# EAGLE design ripples_v40 (EAGLE 5.09)
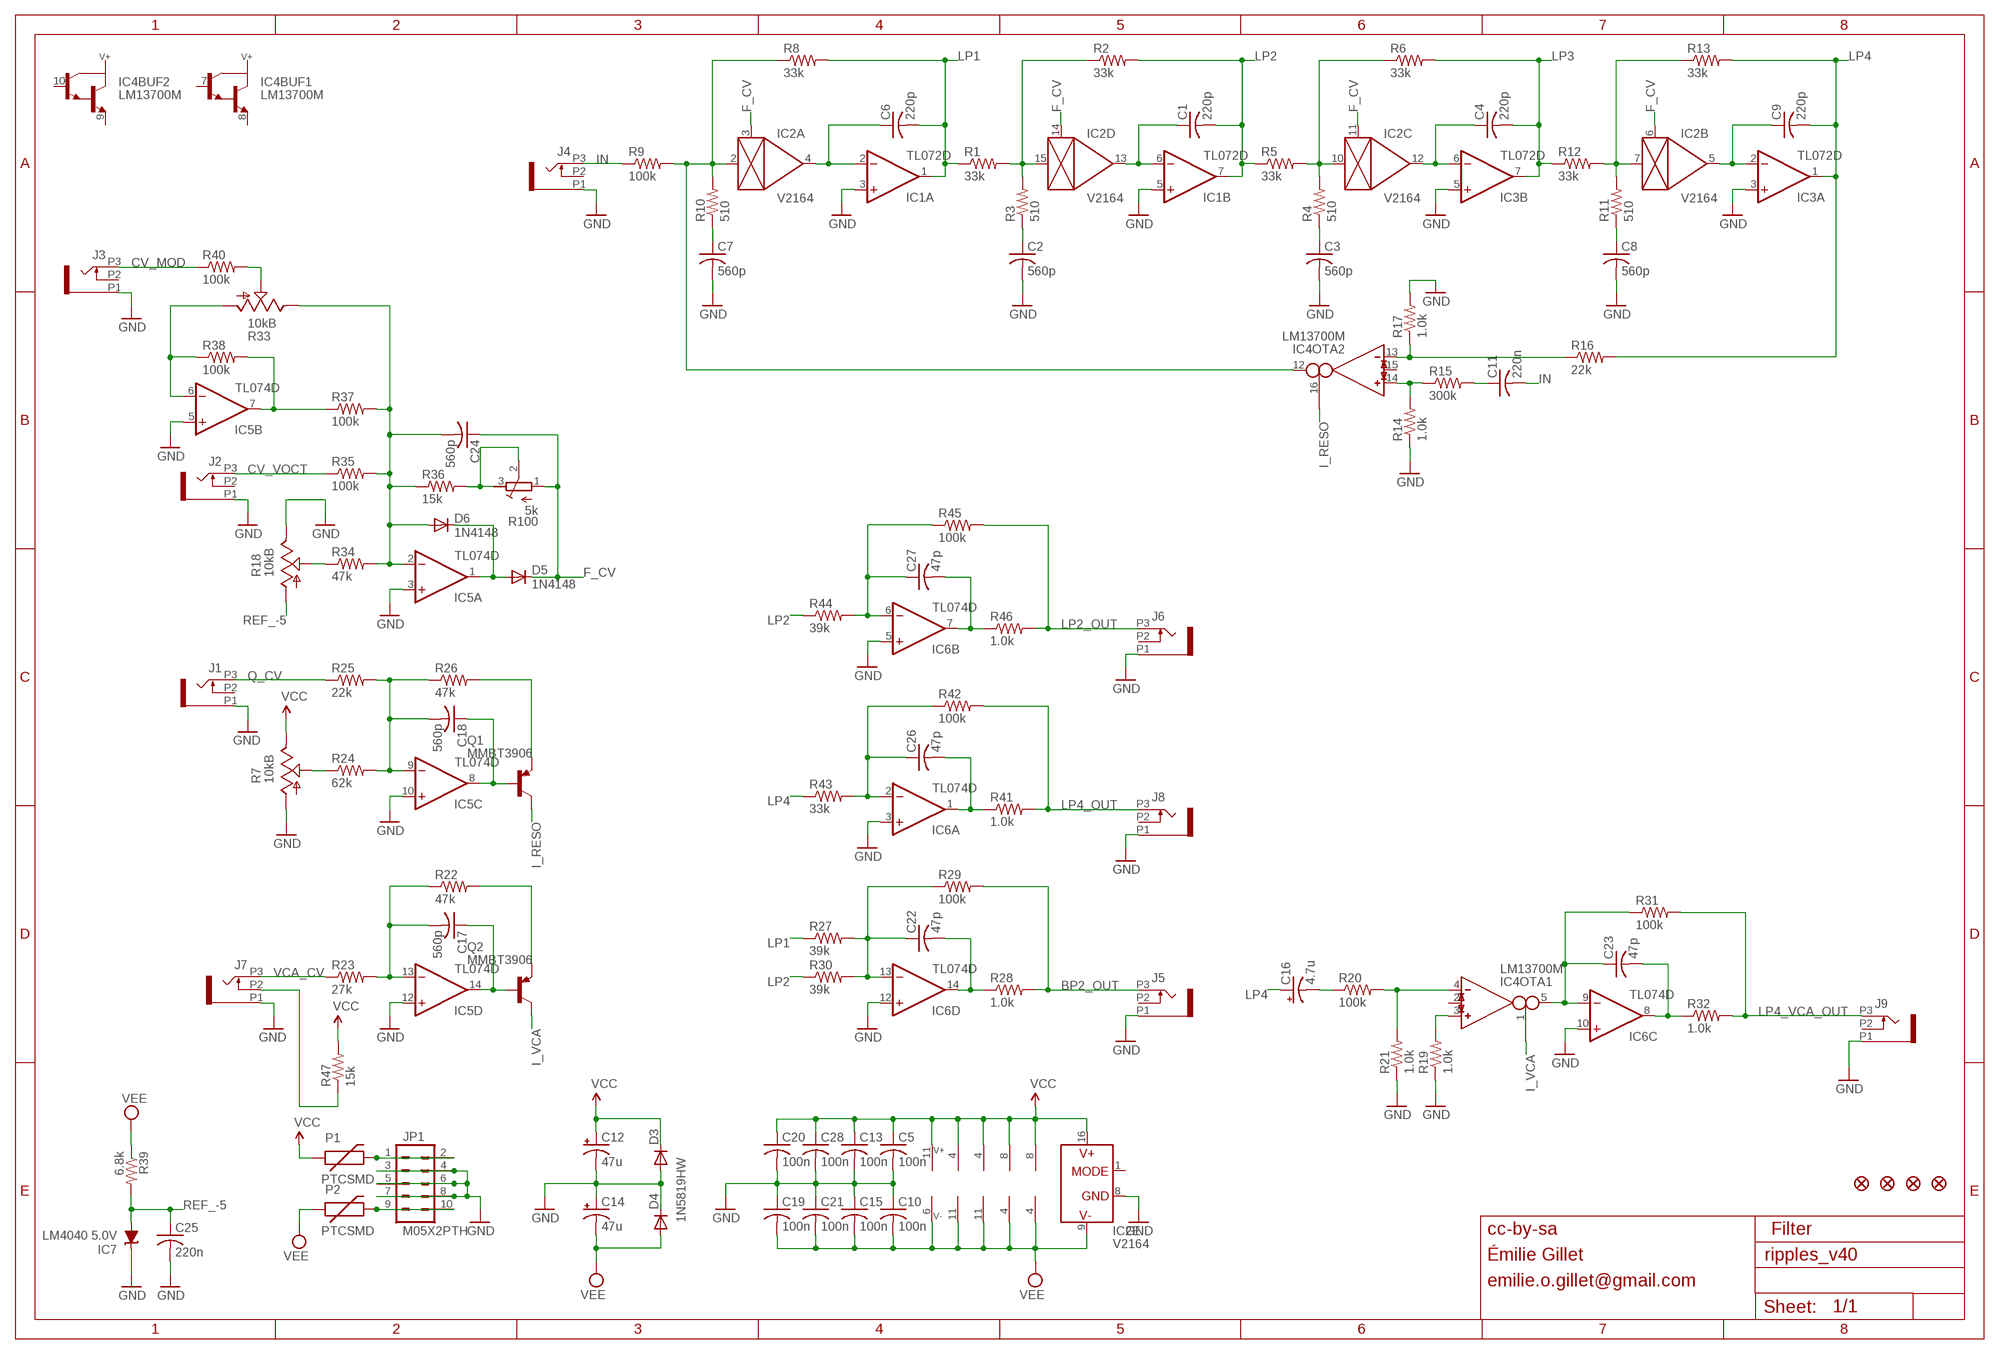
[diagram p0: schematic, sheet 1]

## Parts
C1  220p  C-USC0603  [C0603]
C2  560p  C-USC0603  [C0603]
C3  560p  C-USC0603  [C0603]
C4  220p  C-USC0603  [C0603]
C5  100n  C-USC0603  [C0603]
C6  220p  C-USC0603  [C0603]
C7  560p  C-USC0603  [C0603]
C8  560p  C-USC0603  [C0603]
C9  220p  C-USC0603  [C0603]
C10  100n  C-USC0603  [C0603]
C11  220n  C-USC0603  [C0603]
C12  47u  CPOL-USD  [PANASONIC_D]
C13  100n  C-USC0603  [C0603]
C14  47u  CPOL-USD  [PANASONIC_D]
C15  100n  C-USC0603  [C0603]
C16  4.7u  CPOL-USB  [PANASONIC_B]
C17  560p  C-USC0603  [C0603]
C18  560p  C-USC0603  [C0603]
C19  100n  C-USC0603  [C0603]
C20  100n  C-USC0603  [C0603]
C21  100n  C-USC0603  [C0603]
C22  47p  C-USC0603  [C0603]
C23  47p  C-USC0603  [C0603]
C24  560p  C-USC0603  [C0603]
C25  220n  C-USC0603  [C0603]
C26  47p  C-USC0603  [C0603]
C27  47p  C-USC0603  [C0603]
C28  100n  C-USC0603  [C0603]
D3  1N5819HW  DIODE-SOD123  [SOD123]
D4  1N5819HW  DIODE-SOD123  [SOD123]
D5  1N4148  DIODE-SOD323-W  [SOD323-W]
D6  1N4148  DIODE-SOD323-W  [SOD323-W]
F1  FIDUCIAL1X2  [FIDUCIAL-1X2]
F2  FIDUCIAL1X2  [FIDUCIAL-1X2]
F3  FIDUCIAL1X2  [FIDUCIAL-1X2]
F4  FIDUCIAL1X2  [FIDUCIAL-1X2]
IC1  TL072D  [SO08]
IC2  V2164  SSM2164S  [SOIC16N]
IC3  TL072D  [SO08]
IC4  LM13700M  [SO16]
IC5  TL074D  [SO14]
IC6  TL074D  [SO14]
IC7  LM4040 5.0V  LM4041C12DBZ  [DBZ_R-PDSO-G3]
J1  PJ301_THONKICONN6  [WQP_PJ_301M6]
J2  PJ301_THONKICONN6  [WQP_PJ_301M6]
J3  PJ301_THONKICONN6  [WQP_PJ_301M6]
J4  PJ301_THONKICONN6  [WQP_PJ_301M6]
J5  PJ301_THONKICONN6  [WQP_PJ_301M6]
J6  PJ301_THONKICONN6  [WQP_PJ_301M6]
J7  PJ301_THONKICONN6  [WQP_PJ_301M6]
J8  PJ301_THONKICONN6  [WQP_PJ_301M6]
J9  PJ301_THONKICONN6  [WQP_PJ_301M6]
JP1  M05X2PTH  [AVR_ICSP]
P1  PTCSMD  [PTC-1206]
P2  PTCSMD  [PTC-1206]
Q1  MMBT3906  MMBT3906LT1-PNP-SOT23-BEC  [SOT23-BEC]
Q2  MMBT3906  MMBT3906LT1-PNP-SOT23-BEC  [SOT23-BEC]
R1  33k  R-US_R0603  [R0603]
R2  33k  R-US_R0603  [R0603]
R3  510  R-US_R0603  [R0603]
R4  510  R-US_R0603  [R0603]
R5  33k  R-US_R0603  [R0603]
R6  33k  R-US_R0603  [R0603]
R7  10kB  POT_USVERTICAL_PS  [ALPS_POT_VERTICAL_PS]
R8  33k  R-US_R0603  [R0603]
R9  100k  R-US_R0603  [R0603]
R10  510  R-US_R0603  [R0603]
R11  510  R-US_R0603  [R0603]
R12  33k  R-US_R0603  [R0603]
R13  33k  R-US_R0603  [R0603]
R14  1.0k  R-US_R0603  [R0603]
R15  300k  R-US_R0603  [R0603]
R16  22k  R-US_R0603  [R0603]
R17  1.0k  R-US_R0603  [R0603]
R18  10kB  POT_USVERTICAL_PS  [ALPS_POT_VERTICAL_PS]
R19  1.0k  R-US_R0603  [R0603]
R20  100k  R-US_R0603  [R0603]
R21  1.0k  R-US_R0603  [R0603]
R22  47k  R-US_R0603  [R0603]
R23  27k  R-US_R0603  [R0603]
R24  62k  R-US_R0603  [R0603]
R25  22k  R-US_R0603  [R0603]
R26  47k  R-US_R0603  [R0603]
R27  39k  R-US_R0603  [R0603]
R28  1.0k  R-US_R0603  [R0603]
R29  100k  R-US_R0603  [R0603]
R30  39k  R-US_R0603  [R0603]
R31  100k  R-US_R0603  [R0603]
R32  1.0k  R-US_R0603  [R0603]
R33  10kB  POT_USVERTICAL_PS  [ALPS_POT_VERTICAL_PS]
R34  47k  R-US_R0603  [R0603]
R35  100k  R-US_R0603  [R0603]
R36  15k  R-US_R0603  [R0603]
R37  100k  R-US_R0603  [R0603]
R38  100k  R-US_R0603  [R0603]
R39  6.8k  R-US_R0603  [R0603]
R40  100k  R-US_R0603  [R0603]
R41  1.0k  R-US_R0603  [R0603]
R42  100k  R-US_R0603  [R0603]
R43  33k  R-US_R0603  [R0603]
R44  39k  R-US_R0603  [R0603]
R45  100k  R-US_R0603  [R0603]
R46  1.0k  R-US_R0603  [R0603]
R47  15k  R-US_R0603  [R0603]
R100  5k  R-TRIMM3296X  [RTRIM3296X]

## Nets
BP2_OUT: J5.P3 R28.2 R29.2
CV_F_POT: R18.P$2(S) R34.1
CV_MOD: J3.P3 R40.1
CV_VOCT: J2.P3 R35.1
F_CV: C24.1 D5.C IC2.3(A:CTRL) IC2.6(B:CTRL) IC2.11(C:CTRL) IC2.14(D:CTRL) R100.1(E)
GND: C2.2 C3.2 C5.2 C7.2 C8.2 C10.1 C12.- C13.2 C14.+ C15.1 C19.1 C20.2 C21.1 C25.2 C28.2 D3.A D4.C IC1.3(A:+IN) IC1.5(B:+IN) IC2.8(E:GND) IC3.3(A:+IN) IC3.5(B:+IN) IC5.3(A:+IN) IC5.5(B:+IN) IC5.10(C:+IN) IC5.12(D:+IN) IC6.3(A:+IN) IC6.5(B:+IN) IC6.10(C:+IN) IC6.12(D:+IN) IC7.1(C) J1.P1 J2.P1 J3.P1 J4.P1 J5.P1 J6.P1 J7.P1 J8.P1 J9.P1 JP1.3 JP1.4 JP1.5 JP1.6 JP1.7 JP1.8 R7.P$3(A) R14.1 R17.2 R18.P$1(E) R19.1 R21.1
I_RESO: IC4.16(OTA2:I_BIAS) Q1.C
I_VCA: IC4.1(OTA1:I_BIAS) Q2.C
IN: C11.2 J4.P3 R9.1
LP1: C6.2 IC1.1(A:OUT) R1.1 R8.2 R27.1
LP2: C1.2 IC1.7(B:OUT) R2.2 R5.1 R30.1 R44.1
LP2_OUT: J6.P3 R45.2 R46.2
LP3: C4.2 IC3.7(B:OUT) R6.2 R12.1
LP4: C9.2 C16.+ IC3.1(A:OUT) R13.2 R16.2 R43.1
LP4_OUT: J8.P3 R41.2 R42.2
LP4_VCA_OUT: J9.P3 R31.2 R32.2
N$1: IC5.7(B:OUT) R37.1 R38.2
N$2: C6.1 IC1.2(A:-IN) IC2.4(A:OUT)
N$3: IC2.15(D:IN) R1.2 R2.1 R3.2
N$4: R36.2 R100.2(S) R100.3(A)
N$5: IC4.3(OTA1:IN_P) R19.2
N$6: JP1.1 JP1.2 P1.2
N$7: C11.1 R15.2
N$8: C7.1 R10.1
N$9: C1.1 IC1.6(B:-IN) IC2.13(D:OUT)
N$10: IC2.2(A:IN) IC4.12(OTA2:OUT) R8.1 R9.2 R10.2
N$11: C2.1 R3.1
N$12: IC2.10(C:IN) R4.2 R5.2 R6.1
N$13: C4.1 IC2.12(C:OUT) IC3.6(B:-IN)
N$14: IC4.13(OTA2:IN_N) R16.1 R17.1
N$15: C3.1 R4.1
N$16: IC2.7(B:IN) R11.2 R12.2 R13.1
N$17: C9.1 IC2.5(B:OUT) IC3.2(A:-IN)
N$18: IC4.14(OTA2:IN_P) R14.2 R15.1
N$19: C8.1 R11.1
N$20: JP1.9 JP1.10 P2.2
N$21: R33.P$2(S) R40.2
N$22: IC5.6(B:-IN) R33.P$3(A) R38.1
N$23: C24.2 D6.A IC5.2(A:-IN) R33.P$1(E) R34.2 R35.2 R36.1 R37.2
N$24: R7.P$2(S) R24.1
N$25: C17.2 IC5.13(D:-IN) R22.1 R23.2
N$26: C18.2 IC5.9(C:-IN) R24.2 R25.2 R26.1
N$27: C18.1 IC5.8(C:OUT) Q1.B
N$28: Q1.E R26.2
N$29: J7.P2 R47.1
N$30: C17.1 IC5.14(D:OUT) Q2.B
N$31: Q2.E R22.2
N$32: C27.1 IC6.6(B:-IN) R44.2 R45.1
N$33: C26.1 IC6.2(A:-IN) R42.1 R43.2
N$37: C26.2 IC6.1(A:OUT) R41.1
N$38: D5.A D6.C IC5.1(A:OUT)
N$39: C27.2 IC6.7(B:OUT) R46.1
N$40: C22.1 IC6.13(D:-IN) R27.2 R29.1 R30.2
N$41: C22.2 IC6.14(D:OUT) R28.1
N$42: IC4.4(OTA1:IN_N) R20.2 R21.2
N$43: C23.1 IC4.5(OTA1:OUT) IC6.9(C:-IN) R31.1
N$44: C23.2 IC6.8(C:OUT) R32.1
N$68: C16.- R20.1
Q_CV: J1.P3 R25.1
REF_-5: C25.1 IC7.2(A) R18.P$3(A) R39.2
VCA_CV: J7.P3 R23.1
VCC: C5.1 C12.+ C13.1 C20.1 C28.1 D3.C IC1.8(P:V+) IC2.16(E:V+) IC3.8(P:V+) IC4.11(SUPPLY:V+) IC5.4(P:V+) IC6.4(P:V+) P1.1 R7.P$1(E) R47.2
VEE: C10.2 C14.- C15.2 C19.2 C21.2 D4.A IC1.4(P:V-) IC2.9(E:V-) IC3.4(P:V-) IC4.6(SUPPLY:V-) IC5.11(P:V-) IC6.11(P:V-) P2.1 R39.1
Unconnected: IC2.1(E:MODE) IC4.2(OTA1:I_DIODE) IC4.7(BUF1:B) IC4.8(BUF1:E) IC4.9(BUF2:E) IC4.10(BUF2:B) IC4.15(OTA2:I_DIODE) J1.P2 J2.P2 J3.P2 J4.P2 J5.P2 J6.P2 J8.P2 J9.P2

## Notes on the sheet
- cc-by-sa | Filter
- Émilie Gillet
- emilie.o.gillet@gmail.com

## Library data of the parts
C1-C11 C13 C15 C17-C28 = rcl:C-US: CAPACITOR, American symbol
C12 C14 C16 = rcl:CPOL-US: POLARIZED CAPACITOR, American symbol
D3-D6 = diode:DIODE-: DIODE
F1-F4 = SparkFun:FIDUCIAL: Fiducial Alignment Points Various fiducial points for machine vision alignment.
IC1 IC3 = og-linear:TL072: OP AMP
IC2 = ssm2164:SSM2164
IC4 = ota:LM13700: Dual OTA with buffers
IC5 IC6 = gm-ics:TL074: OP AMP
IC7 = texas:LM4041: PRECISION MICROPOWER SHUNT VOLTAGE REFERENCE Source: http://focus.ti.com/lit/ds/slcs146e/slcs146e.pdf
J1-J9 = og-pj301:PJ301_THONKICONN
JP1 = og-header:M05X2: Header 5x2 Standard 10-pin dual row 0.1" header. Commonly used with AVR-ISP. Use with Spark Fun Electronics SKU: PRT-00778
P1 P2 = SparkFun:PTC: Resettable Fuse PTC Resettable Fuse. Spark Fun Electronics SKU : COM-08357
Q1 Q2 = transistor:*-PNP-: PNP Transistror
R1-R6 R8-R17 R19-R32 R34-R38 R40-R47 = rcl:R-US_: RESISTOR, American symbol
R7 R18 R33 = pot-alps:POT_US
R39 = resistor:R-US_: RESISTOR, American symbol
R100 = rcl:R-TRIMM: Trimm resistor

## Board
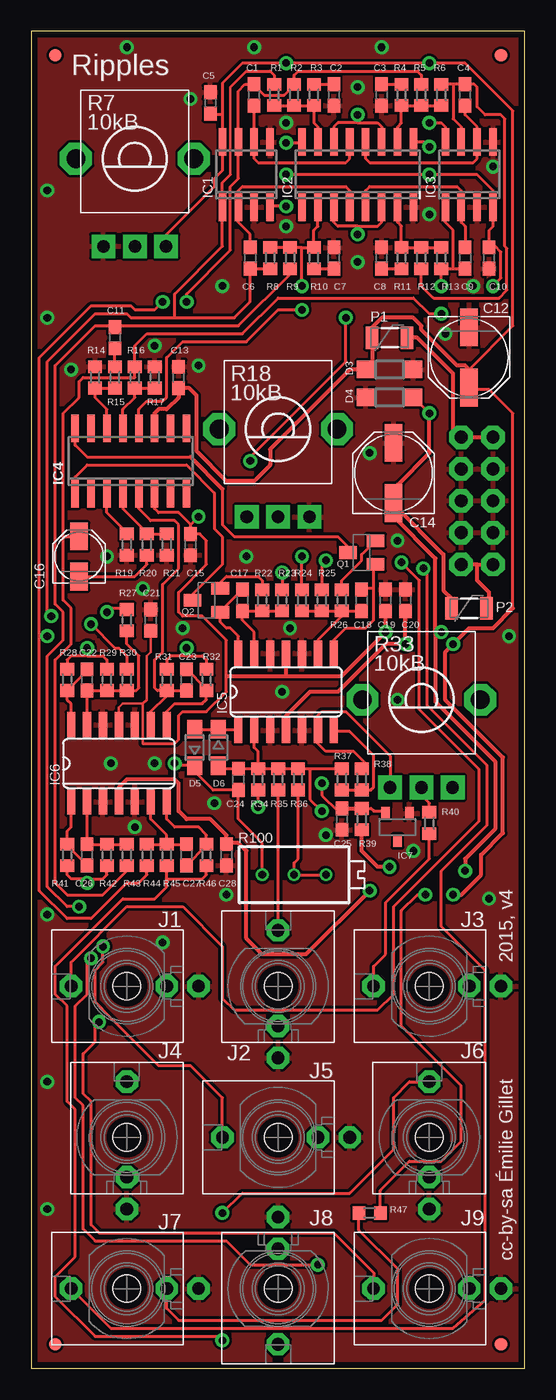
[diagram p1: board, top side]
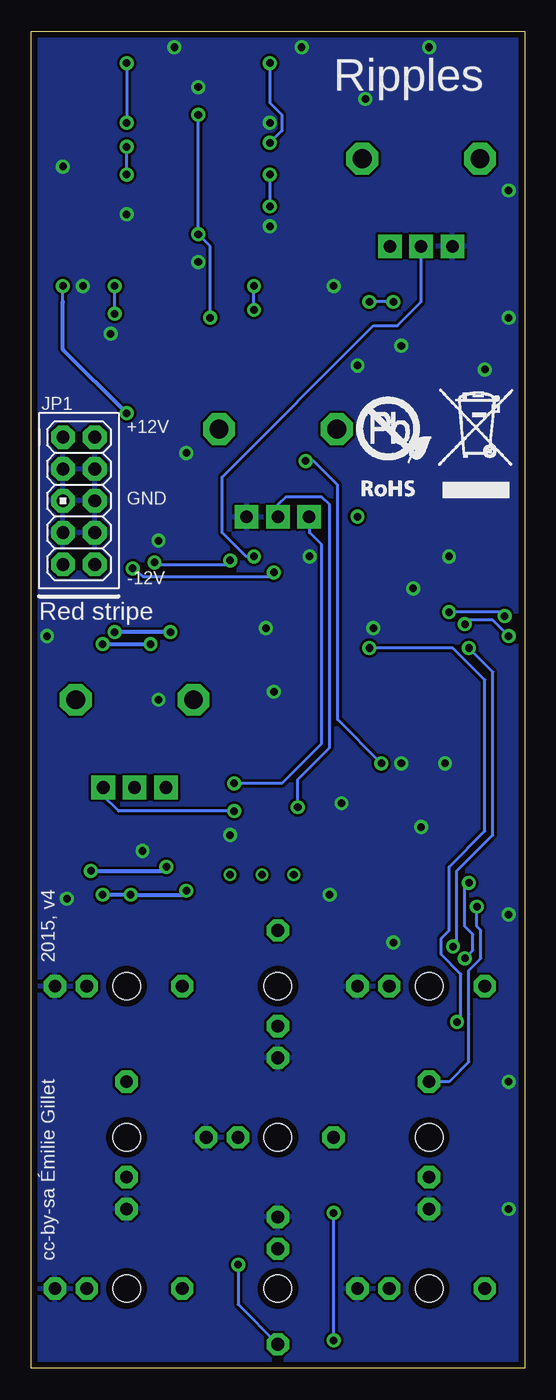
[diagram p2: board, bottom side, seen from below]

Size 39.35 x 106.68 mm. Coordinates in mm from the lower left corner, seen from the top.
Outline: 0,0 39.35,0 39.35,106.68 0,106.68 0,0
Copper layers (1*16): Top 0.035mm / dielectric 1.5mm / Bottom 0.035mm
Design rules "PCBCart-Standard *": minimum track width 8mil, minimum drill 0.4mm, track to track 8mil, track to pad 8mil, pad to pad 8mil, via to via 8mil, smd to smd 8mil, copper to edge 20mil, drill to drill 8mil, minimum pad ring 8mil, minimum via ring 10mil, stop-mask expansion 3mil, vias tented up to drill 25mil, thermal gap 8mil

### Footprints (pad centres in the part's own frame; a part is rotated, then mirrored left to right if it is on the bottom)
C0603 = smd 1.1 x 1: 1 -0.85,0; 2 0.85,0
PANASONIC_D = smd 3 x 1.4: + 2.4,0; - -2.4,0
PANASONIC_B = smd 2.2 x 1.4: + 1.6,0; - -1.6,0
SOD123 = smd 1.4 x 1.4: A 1.9,0; C -1.9,0
SOD323-W = smd 1.5 x 1.2: A 1.45,0; C -1.45,0
FIDUCIAL-1X2 = smd 1 x 1: 1 0,0
SO08 = smd 0.6 x 2.2: 1 -1.905,-2.6; 2 -0.635,-2.6; 3 0.635,-2.6; 4 1.905,-2.6; 5 1.905,2.6; 6 0.635,2.6; 7 -0.635,2.6; 8 -1.905,2.6
SOIC16N = smd 0.6 x 2.2: 1 -4.445,-2.6; 2 -3.175,-2.6; 3 -1.905,-2.6; 4 -0.635,-2.6; 5 0.635,-2.6; 6 1.905,-2.6; 7 3.175,-2.6; 8 4.445,-2.6; 9 4.445,2.6; 10 3.175,2.6; 11 1.905,2.6; 12 0.635,2.6; 13 -0.635,2.6; 14 -1.905,2.6; 15 -3.175,2.6; 16 -4.445,2.6
SO16 = smd 0.6 x 2.2: 1 -4.445,-2.6; 2 -3.175,-2.6; 3 -1.905,-2.6; 4 -0.635,-2.6; 5 0.635,-2.6; 6 1.905,-2.6; 7 3.175,-2.6; 8 4.445,-2.6; 9 4.445,2.6; 10 3.175,2.6; 11 1.905,2.6; 12 0.635,2.6; 13 -0.635,2.6; 14 -1.905,2.6; 15 -3.175,2.6; 16 -4.445,2.6
SO14 = smd 0.66 x 2.032: 1 -3.81,-3.073; 2 -2.54,-3.073; 3 -1.27,-3.073; 4 0,-3.073; 5 1.27,-3.073; 6 2.54,-3.073; 7 3.81,-3.073; 8 3.81,3.073; 9 2.54,3.073; 10 1.27,3.073; 11 0,3.073; 12 -1.27,3.073; 13 -2.54,3.073; 14 -3.81,3.073
DBZ_R-PDSO-G3 = smd 0.7 x 1: 1 -0.95,-1.1; 2 0.95,-1.1; 3 0,1.1
WQP_PJ_301M6 = drill 1.016 pad 1.778 octagon: P1 0,-5.715; P2 0,-3.175; P3 0,4.445 | hole 2.2: 0,0
AVR_ICSP = drill 1.016 pad 1.88 octagon: 1 -1.27,5.08; 2 1.27,5.08; 3 -1.27,2.54; 4 1.27,2.54; 5 -1.27,0; 6 1.27,0; 7 -1.27,-2.54; 8 1.27,-2.54; 9 -1.27,-5.08; 10 1.27,-5.08
PTC-1206 = smd 1 x 1.8: 1 -1.4,0; 2 1.4,0
SOT23-BEC = smd 1 x 1.4: B -0.95,-1.1; C 0,1.1; E 0.95,-1.1
R0603 = smd 1 x 1.1: 1 -0.85,0; 2 0.85,0
ALPS_POT_VERTICAL_PS = drill 1 pad 1.88 square: P$1 -2.5,7; P$2 0,7; P$3 2.5,7 | drill 1.5 pad 2.54 octagon: P$4 -4.7,0; P$5 4.7,0
RTRIM3296X = drill 0.61 round: 1 0,-2.54; 2 0,0; 3 0,2.54

### Placement (x,y rotation side)
C1  17.78,101.6 90 top
C2  24.13,101.6 270 top
C3  27.94,101.6 270 top
C4  34.61,101.6 90 top
C5  14.29,100.97 90 top
C6  17.46,88.58 270 top
C7  24.13,88.58 90 top
C8  27.94,88.58 90 top
C9  34.61,88.58 270 top
C10  36.51,88.58 90 top
C11  6.67,82.23 90 top
C12  34.92,80.64 270 top
C13  11.75,79.06 90 top
C14  28.89,71.44 90 top
C15  12.7,65.72 90 top
C16  3.81,64.77 90 top
C17  16.83,61.28 270 top
C18  26.35,61.28 270 top
C19  28.26,61.28 270 top
C20  29.84,61.28 90 top
C21  9.53,59.69 270 top
C22  4.45,54.93 90 top
C23  12.38,54.93 90 top
C24  16.51,46.99 90 top
C25  24.77,43.81 270 top
C26  4.45,40.96 270 top
C27  12.38,40.96 270 top
C28  15.56,40.96 270 top
D3  28.57,79.69 0 top
D4  28.57,77.47 0 top
D5  13.02,49.53 90 top
D6  14.92,49.53 270 top
F1  1.91,104.78 90 top
F2  37.47,104.78 90 top
F3  1.91,1.91 90 top
F4  37.47,1.91 90 top
IC1  17.14,95.25 0 top
IC2  26.04,95.25 0 top
IC3  34.92,95.25 0 top
IC4  7.94,72.39 0 top
IC5  20.32,53.98 0 top
IC6  6.99,48.26 0 top
IC7  29.21,43.18 180 top
J1  7.62,30.48 90 top
J2  19.68,30.48 0 top
J3  31.75,30.48 90 top
J4  7.62,18.41 0 top
J5  19.68,18.41 90 top
J6  31.75,18.41 0 top
J7  7.62,6.35 90 top
J8  19.68,6.35 180 top
J9  31.75,6.35 90 top
JP1  35.56,69.22 0 bottom
P1  28.57,82.23 0 top
P2  34.92,60.64 0 top
Q1  26.35,65.09 90 top
Q2  13.97,61.28 90 top
R1  19.37,101.6 270 top
R2  20.95,101.6 90 top
R3  22.54,101.6 270 top
R4  29.53,101.6 270 top
R5  31.11,101.6 270 top
R6  32.7,101.6 90 top
R7  8.26,96.52 180 top
R8  19.05,88.58 270 top
R9  20.64,88.58 90 top
R10  22.54,88.58 90 top
R11  29.53,88.58 90 top
R12  31.11,88.58 90 top
R13  32.7,88.58 270 top
R14  5.08,79.06 270 top
R15  6.67,79.06 90 top
R16  8.26,79.06 90 top
R17  9.84,79.06 90 top
R18  19.68,74.93 180 top
R19  7.62,65.72 90 top
R20  9.21,65.72 90 top
R21  10.79,65.72 90 top
R22  18.41,61.28 90 top
R23  20,61.28 270 top
R24  21.59,61.28 270 top
R25  23.18,61.28 270 top
R26  24.77,61.28 90 top
R27  7.62,59.69 270 top
R28  2.86,54.93 90 top
R29  6.03,54.93 90 top
R30  7.62,54.93 270 top
R31  10.79,54.93 90 top
R32  13.97,54.93 90 top
R33  31.11,53.34 180 top
R34  18.1,46.99 90 top
R35  19.68,46.99 90 top
R36  21.27,46.99 270 top
R37  24.77,46.99 90 top
R38  26.35,46.99 270 top
R39  26.35,43.81 90 top
R40  31.75,43.5 90 top
R41  2.86,40.96 270 top
R42  6.03,40.96 270 top
R43  7.62,40.96 90 top
R44  9.21,40.96 90 top
R45  10.79,40.96 270 top
R46  13.97,40.96 270 top
R47  26.99,12.38 0 top
R100  20.95,39.37 270 top
U$2  [ROHS]  14.29,68.9 0 bottom

### Tracks (layer width: path | path; a pad name or v marks a point on that pad's centre or on a via)
BP2_OUT  (via drill 0.6)
  Top 0.254: R28.2 2.86,56.52 3.17,56.83 4.45,56.83 | R29.2 6.03,56.52 5.71,56.83 4.45,56.83 | v4.45,57.47 4.45,56.83 | v5.71,33.66 5.71,32.38 5.08,31.75 5.08,29.21 6.35,27.94 7.62,26.67 10.16,24.13 12.7,24.13 15.24,21.59 J5.P3
  Bottom 0.254: v4.45,57.47 2.54,55.56 2.54,42.55 5.4,39.69 5.4,33.97 v5.71,33.66
CV_F_POT  (via drill 0.6)
  Top 0.254: v18.1,44.77 R34.1
  Bottom 0.254: v18.1,44.77 18.1,46.99 15.56,49.53 15.56,68.9 16.19,69.53 19.05,69.53 19.68,68.9 R18.P$2
CV_MOD
  Top 0.254: R40.1 31.75,40.64 28.26,37.15 28.26,33.02 27.3,32.07 J3.P3
CV_VOCT
  Top 0.254: J2.P3 R35.1
F_CV  (via drill 0.6)
  Top 0.254: IC2.11 27.94,99.06 27.62,99.38 26.04,99.38 | 26.04,99.38 24.45,99.38 24.13,99.06 IC2.14 | IC2.3 24.13,91.44 24.45,91.12 26.04,91.12 | IC2.6 27.94,91.44 27.62,91.12 26.04,91.12 | v26.04,90.49 26.04,91.12 | v26.04,100.01 26.04,99.38 | v17.46,72.39 17.46,72.71 25.08,80.33 v25.08,83.82 | v11.43,48.26 11.61,48.08 D5.C 13.02,47.62 14.5,46.14 C24.1 16.51,43.81 18.41,41.91 R100.1
  Bottom 0.254: v26.04,100.01 v26.04,90.49 25.08,89.53 v25.08,83.82 | v11.43,48.26 14.92,51.75 14.92,70.48 16.83,72.39 v17.46,72.39
GND  (via drill 0.6)
  other vias: 26.04,102.23 26.04,88.27 20.32,99.38 20.32,91.12 31.75,92.08 36.83,95.89 35.24,86.36 12.7,101.28 9.84,81.6 3.17,79.69 8.89,62.23 6.03,64.77 12.06,59.05 13.34,80.01 6.35,48.26 8.26,43.18 33.02,82.55 26.99,73.03 29.21,66.04 30.48,41.27 14.61,45.09 23.5,42.55 20.64,59.05 17.14,64.77 9.84,48.26 20,53.98 1.27,36.2 10.48,33.97 7.62,105.41 17.78,105.41 27.94,105.41 1.27,93.98 1.27,83.82 38.1,58.42 36.51,37.47 1.27,22.86 1.27,12.7 29.21,53.34 15.24,86.36 15.56,37.78
  pour Bottom: 0,106.68 0,0 39.37,0 39.37,106.68
  pour Top: 0,106.68 0,0 39.37,0 39.37,106.68
I_RESO
  Top 0.254: IC4.16 3.49,73.66 4.45,72.71 12.7,72.71 | 15.24,70.17 15.24,67.31 16.19,66.36 24.45,66.36 25.25,65.55 Q1.C
  Top 0.305: 12.7,72.71 15.24,70.17
I_VCA
  Top 0.254: IC4.1 3.49,71.12 4.45,72.07 12.38,72.07 14.61,69.85 14.61,66.99 15.24,66.36 15.24,64.14 12.87,61.77 Q2.C
IN  (via drill 0.6)
  Top 0.254: R9.1 20.64,87.31 16.51,83.19 6.67,83.19 | 6.67,83.19 5.08,83.19 1.91,80.01 1.91,60.96 2.54,60.33 2.54,58.1 1.27,56.83 1.27,38.42 2.86,36.83 v3.81,36.83 | 6.67,83.19 C11.2
  Bottom 0.254: J4.P3 6.03,22.86 4.45,24.45 4.45,28.26 4.45,31.75 3.49,32.7 3.49,34.92 3.81,35.24 v3.81,36.83
LP1  (via drill 0.6)
  Top 0.203: 15.88,95.25 15.88,102.23
  Top 0.254: R8.2 C6.2 17.46,85.09 16.19,83.82 11.43,83.82 | 15.88,95.25 15.24,94.61 IC1.1 15.24,89.53 11.43,85.72 11.43,83.82 | 15.88,102.23 17.14,103.5 19.05,103.5 19.37,103.19 R1.1 | 11.43,83.82 7.94,83.82 7.62,84.14 5.08,84.14 1.27,80.33 1.27,60.33 v1.59,60.01 | R27.1 7.52,60.64 6.35,60.64 v6.03,60.33
  Bottom 0.254: v1.59,60.01 1.91,60.33 v6.03,60.33
LP2  (via drill 0.6)
  Top 0.254: R5.1 31.11,103.19 30.8,103.5 21.27,103.5 20.95,103.19 R2.2 20.95,102.39 20.16,101.6 18.57,101.6 17.78,102.39 C1.2 17.04,102.45 16.51,101.92 IC1.7 16.51,94.93 15.88,94.3 15.88,89.22 12.38,85.72 v12.38,85.09 | v10.48,85.09 9.84,84.45 8.26,84.45 7.94,84.77 4.76,84.77 0.64,80.64 0.64,58.42 | 0.64,58.42 0.64,38.1 2.86,35.88 4.76,35.88 7.62,38.73 8.57,38.73 9.21,39.37 R44.1 | R30.1 7.62,56.83 6.99,57.47 6.67,57.47 v4.76,59.37 | 0.64,58.42 v1.27,58.42
  Bottom 0.254: v10.48,85.09 v12.38,85.09 | v1.27,58.42 2.54,59.69 4.45,59.69 v4.76,59.37
LP2_OUT  (via drill 0.6)
  Top 0.254: R46.2 13.97,39.37 13.65,39.05 10.79,39.05 | 10.79,39.05 10.79,38.42 9.84,37.47 7.3,37.47 1.91,32.07 1.91,29.84 2.86,28.89 2.86,21.27 3.49,20.64 3.49,8.89 1.91,7.3 1.91,5.71 5.08,2.54 14.92,2.54 v15.24,2.22 | 10.79,39.05 R45.2 | v15.24,12.38 16.83,13.97 25.4,13.97 28.89,17.46 28.89,21.59 30.16,22.86 J6.P3
  Bottom 0.254: v15.24,2.22 v15.24,12.38
LP3
  Top 0.254: 33.66,102.45 R6.2 | 33.66,102.45 C4.2 35.34,102.45 35.56,102.23 35.56,100.65 36.2,100.01 37.47,100.01 37.78,99.69 37.78,89.53 37.94,89.38 37.94,86.04 37.31,85.41 32.07,85.41 31.11,86.36 R12.1 | IC3.7 34.29,99.06 33.66,99.69 33.66,102.45
LP4  (via drill 0.6)
  Top 0.254: 33.66,87.73 R13.2 v32.7,86.36 | 33.66,87.73 C9.2 | IC3.1 33.02,91.44 33.66,90.81 33.66,87.73 | v32.7,84.14 31.75,84.14 30.48,85.41 19.68,85.41 16.83,82.55 9.21,82.55 8.26,81.6 R16.2 8.26,79.06 4.13,79.06 3.81,78.74 3.81,77.47 2.54,76.2 2.54,66.36 | R43.1 7.62,39.69 5.71,37.78 2.86,37.78 1.91,38.73 1.91,56.52 3.17,57.78 3.17,60.64 2.54,61.28 2.54,66.36 | C16.+ 3.67,66.67 3.35,66.36 2.54,66.36
  Bottom 0.254: v32.7,84.14 v32.7,86.36
LP4_OUT  (via drill 0.6)
  Top 0.254: R42.2 6.03,39.37 5.71,39.05 4.45,39.05 | R41.2 2.86,39.37 3.17,39.05 4.45,39.05 | v4.45,38.73 4.45,39.05 | v4.76,32.7 4.45,32.38 4.45,29.84 3.49,28.89 3.49,21.59 4.13,20.95 4.13,11.11 5.08,10.16 15.56,10.16 17.46,8.26 v22.86,8.26
  Bottom 0.254: v4.45,38.73 4.76,38.42 4.76,35.24 4.13,34.61 4.13,33.34 v4.76,32.7 | v22.86,8.26 22.86,5.08 J8.P3
LP4_VCA_OUT  (via drill 0.6)
  Top 0.254: R32.2 13.97,56.52 13.65,56.83 12.38,56.83 | R31.2 10.79,56.52 11.11,56.83 12.38,56.83 | v12.38,57.47 12.38,56.83 | v5.4,27.62 5.08,27.3 5.08,26.04 4.13,25.08 4.13,21.91 4.76,21.27 4.76,11.43 5.4,10.79 24.13,10.79 27.3,7.62 J9.P3
  Bottom 0.254: v12.38,57.47 5.71,57.47 3.17,54.93 3.17,42.86 6.03,40.01 6.03,34.92 6.67,34.29 6.67,33.02 5.08,31.43 5.08,27.94 v5.4,27.62
N$1
  Top 0.254: IC5.7 24.23,50.8 25.4,50.8 27.3,48.9 27.3,46.35 27.09,46.14 R38.2 R37.1
N$2
  Top 0.254: IC2.4 25.4,93.98 25.08,94.3 16.83,94.3 16.51,93.98 IC1.2 16.51,91.44 17.46,90.49 C6.1 17.43,89.4
N$3
  Top 0.254: IC2.15 22.86,99.06 22.54,99.38 R3.2 R2.1 R1.2
N$4
  Top 0.254: R36.2 21.27,40.64 20.95,40.32 R100.2 R100.3
N$5
  Top 0.254: IC4.3 6.03,68.26 7.62,66.67 R19.2
N$6
  Top 0.305: P1.2 29.66,82.23 30.8,82.23 33.66,79.38 33.66,74.93 JP1.2 JP1.1
N$7
  Top 0.254: R15.2 C11.1
N$8
  Top 0.254: R10.1 C7.1
N$9
  Top 0.254: IC2.13 25.4,96.52 25.08,96.2 18.1,96.2 17.78,96.52 IC1.6 C1.1
N$10  (via drill 0.6)
  Top 0.254: R8.1 R9.2 21.59,89.43 | 21.59,89.43 R10.2 22.54,90.81 22.86,91.12 IC2.2 | IC4.12 8.57,76.52 9.21,77.15 10.48,77.15 10.79,77.47 10.79,80.64 12.06,81.92 17.14,81.92 19.68,84.45 v21.59,84.45 | v21.59,86.36 21.59,89.43
  Bottom 0.254: v21.59,84.45 v21.59,86.36
N$11
  Top 0.254: R3.1 C2.1
N$12
  Top 0.254: IC2.10 29.21,99.06 29.53,99.38 R4.2 R5.2 R6.1
N$13
  Top 0.254: IC2.12 26.67,96.52 26.99,96.2 35.24,96.2 35.56,96.52 IC3.6 35.56,99.06 34.61,100.01 C4.1
N$14
  Top 0.254: IC4.13 7.3,76.52 8.26,77.47 R16.1 R17.1
N$15
  Top 0.254: C3.1 R4.1
N$16
  Top 0.254: IC2.7 29.21,91.44 29.53,91.12 R11.2 R12.2 R13.1
N$17
  Top 0.254: IC2.5 26.67,93.98 26.99,94.3 33.97,94.3 34.29,93.98 IC3.2 34.29,91.44 34.61,91.12 C9.1
N$18
  Top 0.254: IC4.14 6.03,76.52 5.08,77.47 R14.2 R15.1
N$19
  Top 0.254: C8.1 R11.1
N$20
  Top 0.305: 35.56,64.14 JP1.10 | 35.56,64.14 JP1.9 | P2.2 36.51,61.47 36.51,61.91 35.56,62.87 35.56,64.14
N$21
  Top 0.254: R40.2 31.75,45.09 31.11,45.72 R33.P$2
N$22
  Top 0.254: R38.1 26.67,48.26 25.72,49.21 23.5,49.21 22.86,49.85 IC5.6 22.86,52.07 23.18,52.39 25.08,52.39 28.61,48.85 R33.P$3
N$23  (via drill 0.6)
  Top 0.254: D6.A 15.48,47.84 C24.2 R34.2 | IC5.2 17.78,49.53 18.1,49.21 R34.2 | 22.23,47.84 R36.1 R35.2 R34.2 | v23.18,44.45 22.23,45.4 22.23,47.84 | 22.23,47.84 R37.2
  Bottom 0.254: R33.P$1 33.66,46.3 33.66,45.72 32.38,44.45 v23.18,44.45
N$24  (via drill 0.6)
  Top 0.254: R24.1 v21.59,64.77
  Bottom 0.254: v21.59,64.77 22.23,64.77 24.13,66.67 24.13,71.12 12.06,83.19 10.16,83.19 8.26,85.09 R7.P$2
N$25
  Top 0.254: R23.2 R22.1 C17.2 16.83,59.69 17.78,58.74 IC5.13
N$26
  Top 0.254: R26.1 C18.2 | R24.2 R25.2 R26.1 | IC5.9 22.86,58.1 24.77,60.01 R26.1
N$27
  Top 0.254: IC5.8 24.13,58.1 25.08,59.05 26.67,59.05 27.3,59.69 27.3,62.23 | 27.3,62.23 27.3,63.67 27.45,63.82 Q1.B | C18.1 26.45,62.23 27.3,62.23
N$28
  Top 0.254: Q1.E 26.35,64.94 26.35,64.45 24.77,62.87 R26.2
N$29
  Top 0.254: R47.1 26.14,11.01 29.21,7.94 29.21,5.08 27.94,3.81 11.75,3.81 10.79,4.76 J7.P2
N$30
  Top 0.254: IC5.14 16.51,58.42 15.88,59.05 15.56,59.05 15.07,59.54 Q2.B 15.07,60.37 C17.1
N$31
  Top 0.254: R22.2 18.41,62.87 18.1,63.18 15.56,63.18 15.07,62.7 Q2.E
N$32
  Top 0.254: R44.2 R45.1 | R45.1 C27.1 | IC6.6 9.53,43.81 10.79,42.55 R45.1
N$33
  Top 0.254: R43.2 R42.1 C26.1 IC6.2
N$37
  Top 0.254: C26.2 2.86,41.7 R41.1 2.86,42.86 3.17,43.18 IC6.1
N$38
  Top 0.254: IC5.1 16.43,50.98 D6.C D5.A
N$39
  Top 0.254: IC6.7 10.79,43.81 11.43,43.18 13.34,43.18 13.97,42.55 R46.1 13.97,41.7 C27.2
N$40
  Top 0.254: IC6.13 C22.1 R29.1 R30.2 8.36,54.08 8.57,54.29 8.57,56.83 7.62,57.78 R27.2 7.72,58.74
N$41
  Top 0.254: IC6.14 3.17,53.02 2.86,53.34 R28.1 4.45,55.66 C22.2
N$42
  Top 0.254: R21.2 R20.2 9.21,66.67 7.3,68.58 IC4.4
N$43
  Top 0.254: R31.1 C23.1 | R31.1 10.06,54.08 9.84,54.29 9.84,56.52 10.48,57.15 10.48,62.55 11.75,63.82 11.75,67.31 11.43,67.63 9.53,67.63 8.57,68.58 IC4.5 | IC6.9 9.53,52.39 10.79,53.66 R31.1
N$44
  Top 0.254: C23.2 13.97,54.19 R32.1 13.97,53.34 13.65,53.02 11.43,53.02 10.79,52.39 IC6.8
N$68
  Top 0.254: R20.1 9.21,64.14 8.24,63.17 C16.-
Q_CV  (via drill 0.6)
  Top 0.254: v29.53,64.29 30.96,62.87 30.96,52.55 35.72,47.78 35.72,43.66 28.89,36.83 28.89,29.84 27.62,28.57 16.19,28.57 15.24,29.53 15.24,33.66 12.06,36.83 7.62,36.83 3.17,32.38 J1.P3 | v23.5,64.45 23.18,64.14 R25.1
  Bottom 0.254: v23.5,64.45 23.81,64.14 29.37,64.14 v29.53,64.29
REF_-5  (via drill 0.6)
  Top 0.254: C25.1 24.98,44.45 24.45,44.45 23.18,45.72 v23.18,46.67 | IC7.2 28.09,44.45 27.3,44.45 27.09,44.66 R39.2
  Top 0.305: C25.1 R39.2
  Bottom 0.254: R18.P$3 17.14,67.89 17.14,66.67 16.19,65.72 16.19,49.85 19.37,46.67 v23.18,46.67
VCA_CV  (via drill 0.6)
  Top 0.254: v20,63.5 R23.1 | v31.27,63.82 31.59,63.5 31.59,52.86 36.35,48.1 36.35,43.34 32.7,39.69 32.7,35.24 36.2,31.75 36.2,5.4 33.66,3.17 6.35,3.17 J7.P3
  Bottom 0.254: v31.27,63.82 30.48,63.18 20.32,63.18 v20,63.5
VCC  (via drill 0.6)
  Top 0.254: C13.1 11.85,78.11 | R7.P$1 10.76,90.45 14.61,94.3 14.61,94.93 15.24,95.57 IC1.8 15.24,100.01 | IC3.8 33.02,99.06 32.7,99.38 v31.75,99.38 | 15.24,100.01 15.24,102.55 16.83,104.14 v20.32,104.14 v31.75,104.14 34.61,104.14 38.42,100.33 38.42,83.19 34.92,79.69 | 15.24,100.01 14.39,100.01 | v20.32,97.79 21.53,97.79 | 35.06,78.11 36.51,78.11 38.42,76.2 38.42,60.64 | v31.43,37.78 30.8,37.78 29.53,36.51 29.53,27.3 34.29,22.54 34.29,18.1 32.7,16.51 30.16,16.51 27.84,14.19 R47.2
  Top 0.305: IC4.11 9.84,76.2 10.16,76.52 10.79,76.52 11.75,77.47 C13.1 12.6,78.21 13.18,77.63 13.18,73.18 15.56,70.8 17.78,70.8 19.05,72.07 19.05,73.34 25.4,79.69 D3.C | IC6.4 6.99,46.35 7.62,46.99 11.43,46.99 11.75,46.67 11.75,44.45 12.38,43.81 14.29,43.81 15.56,42.55 C28.1 15.66,41.91 16.51,41.91 17.14,41.27 17.14,34.29 18.41,33.02 21.91,33.02 v26.99,38.1 | IC5.4 20.32,52.07 22.23,53.98 24.45,53.98 28.26,57.78 v29.84,57.78 C20.1 29.84,59.69 | v33.66,37.78 34.29,37.78 35.88,39.37 35.88,40.96 37.62,42.7 37.62,48.74 33.02,53.34 33.02,57.15 v33.66,57.78 34.92,59.05 36.83,59.05 38.42,60.64 | P1.1 26.99,82.05 | D3.C | D3.C 27.18,80.19 P1.1 | P1.1 27.18,83.06 27.94,83.82 30.48,83.82 31.11,83.19 31.11,82.87 33.97,80.01 34.61,80.01 34.92,79.69 C12.+ 35.06,78.11 | 14.39,100.01 C5.1 | 21.53,97.79 IC2.16
  Bottom 0.254: v31.75,104.14 v31.75,99.38 | v20.32,97.79 19.37,98.74 19.37,100.01 20.32,100.97 v20.32,104.14
  Bottom 0.305: v33.66,57.78 v29.84,57.78 | v33.66,37.78 v31.43,37.78 27.3,37.78 v26.99,38.1
VEE  (via drill 0.6)
  Top 0.203: C21.2 9.53,57.15 9.21,56.83 9.21,53.34 8.89,53.02 | IC6.11 6.99,52.7 7.3,53.02 8.89,53.02 | 8.89,53.02 8.89,49.85
  Top 0.254: IC1.4 19.11,92.71 v20.32,92.71 | v20.32,95.25 v31.75,95.25 35.56,95.25 36.83,93.98 IC3.4 36.83,91.12 36.51,90.81 C10.2 36.62,89.53 36.99,89.53 37.47,89.06 37.47,87 v36.83,86.36 | v31.75,97.47 31.37,97.85 IC2.9 | C14.- 29.21,69.36 | 8.89,49.85 11.43,49.85 11.75,50.16 11.75,52.07 12.06,52.39 13.97,52.39 15.56,53.98 15.56,55.24 15.56,58.1 13.65,60.01 12.06,60.01 11.75,60.33 11.75,61.91 13.97,64.14 13.97,66.04 13.44,66.57 C15.2 12.7,67.31 | IC4.6 9.84,68.58 10.16,68.26 11.75,68.26 12.7,67.31 | 12.7,67.31 v13.34,67.94 | D4.A v31.75,76.2
  Top 0.305: 29.21,69.36 29.21,70.48 31.75,73.03 v31.75,76.2 | 29.39,69.04 C14.- 28.89,68.9 | 32.23,58.74 32.23,64.61 28.89,67.94 28.89,68.9 | C19.2 v28.26,58.74 24.77,55.24 20.32,55.24 | R39.1 26.35,41.27 27.62,40.01 v28.57,40.01 | v34.61,39.69 34.61,40.64 36.99,43.02 36.99,48.42 32.23,53.18 32.23,58.74 | v32.7,58.74 32.23,58.74 | 15.56,55.24 20.32,55.24 | 20.32,55.24 IC5.11 | 28.89,68.9 32.86,64.93 32.86,62.07 33.52,61.41 P2.1
  Bottom 0.254: 36.83,85.09 v36.83,86.36 | v31.75,95.25 v31.75,97.47 | v20.32,95.25 v20.32,92.71
  Bottom 0.305: 36.83,85.09 36.83,81.28 v31.75,76.2 | v28.26,58.74 v32.7,58.74 | v34.61,39.69 28.89,39.69 v28.57,40.01

### Text on the board
bPlace: Red stripe
tNames: Ripples | 2015, v4 | cc-by-sa Émilie Gillet
bNames: Ripples | +12V | GND | -12V | 2015, v4 | cc-by-sa Émilie Gillet